# EAGLE design uc4h tfmini v0201 (EAGLE 7.5.0)
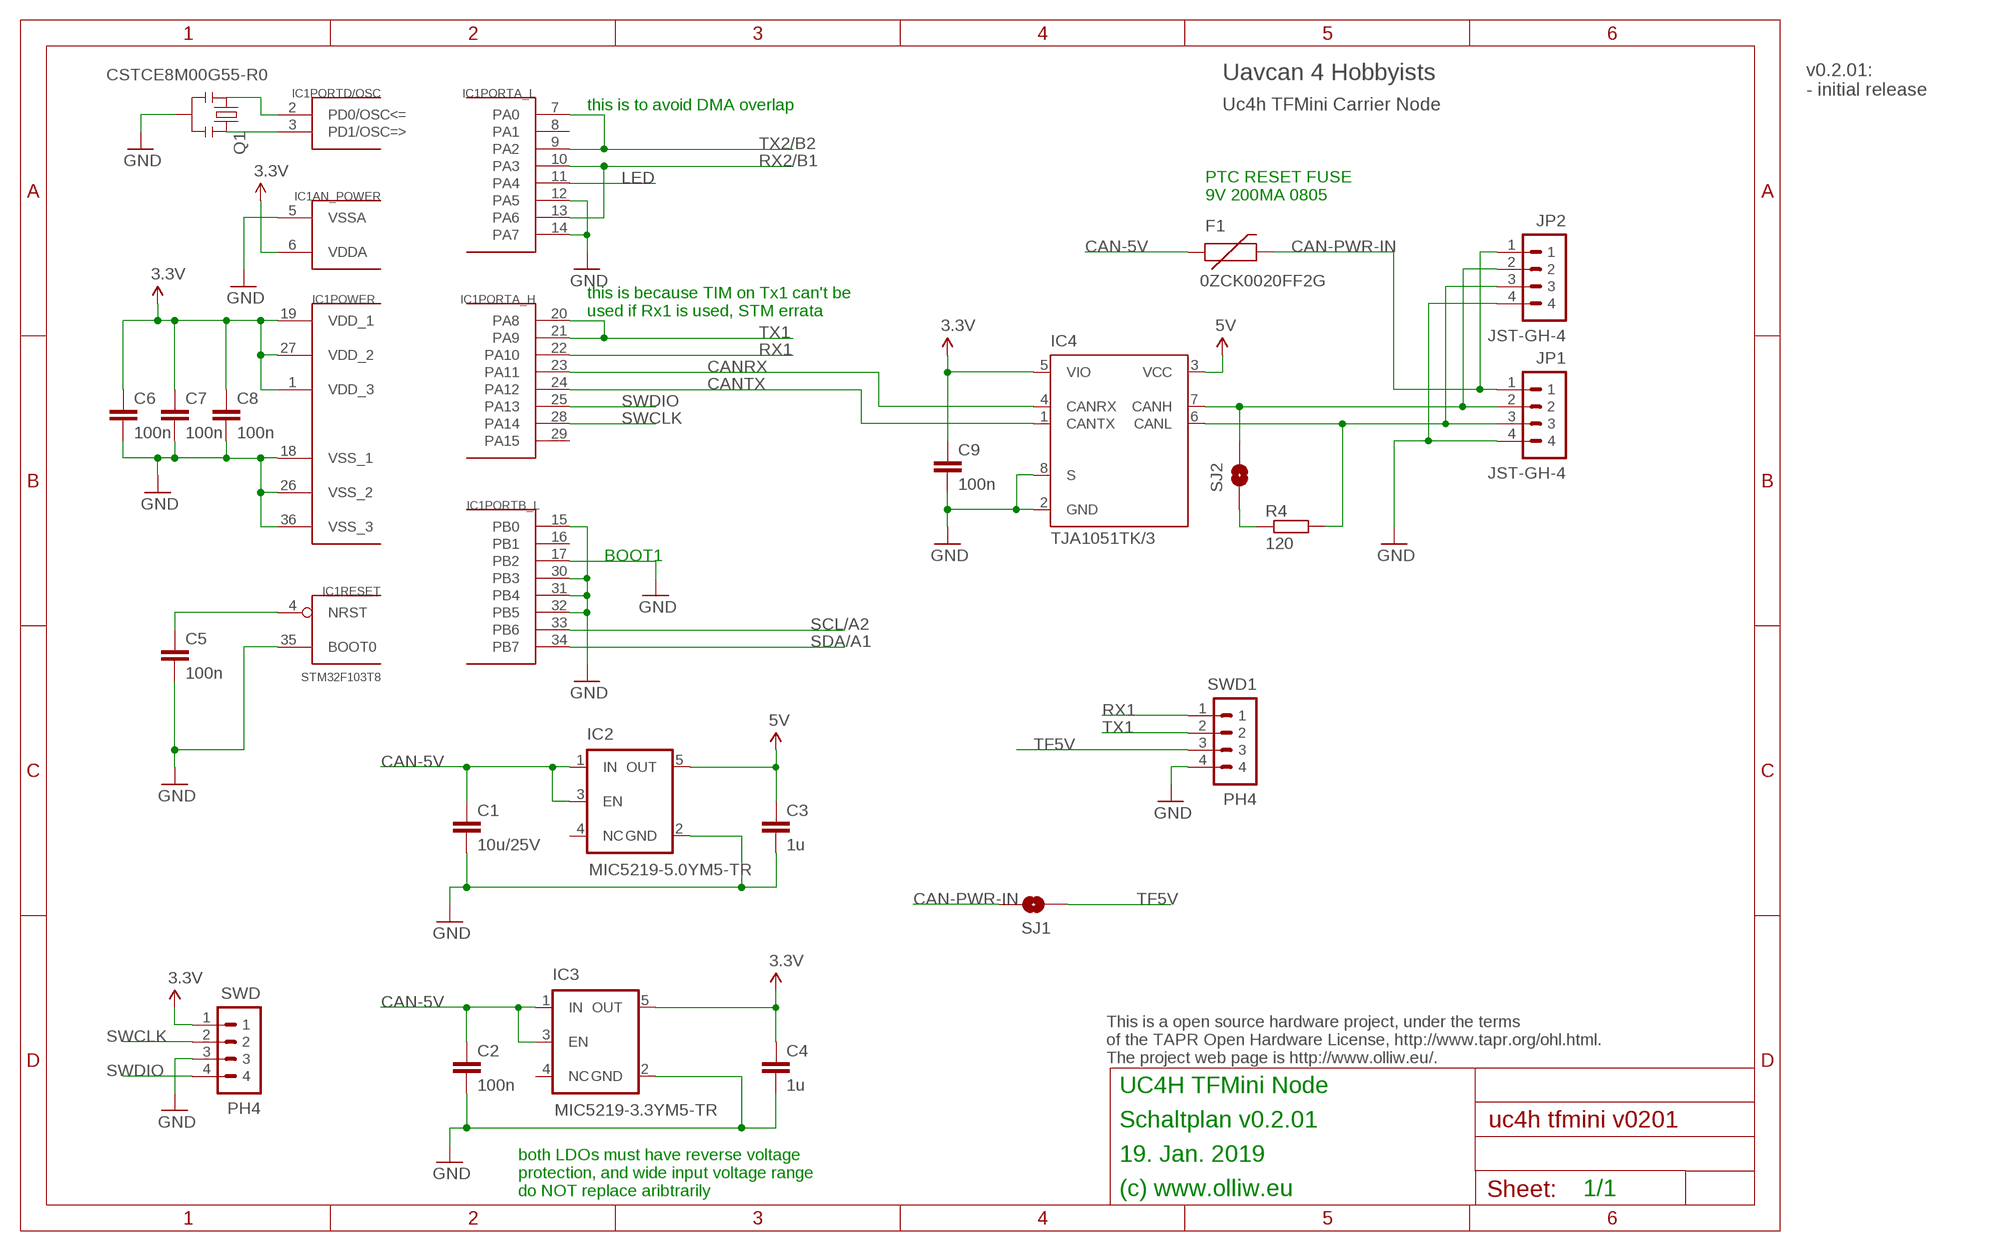
[diagram p0: schematic, sheet 1]

## Parts
C1  10u/25V  C-EUC1206  [C1206]
C2  100n  C-EUC0603K  [C0603K]
C3  1u  C-EUC0603K  [C0603K]
C4  1u  C-EUC0603K  [C0603K]
C5  100n  C-EUC0603K  [C0603K]
C6  100n  C-EUC0603K  [C0603K]
C7  100n  C-EUC0603K  [C0603K]
C8  100n  C-EUC0603K  [C0603K]
C9  100n  C-EUC0603K  [C0603K]
F1  0ZCK0020FF2G  FUSE-PTCFUSE-0805  [FUSE-0805]
IC1  STM32F103T8  STM32F10XTXU6  [VFQFPN36]
IC2  MIC5219-5.0YM5-TR  V_REG_TPS76433SOT23-5  [SOT23-5]
IC3  MIC5219-3.3YM5-TR  V_REG_TPS76433SOT23-5  [SOT23-5]
IC4  TJA1051TK/3  [HVSON8]
JP1  JST-GH-4  [SM04B-GHS-TB]
JP2  JST-GH-4  [SM04B-GHS-TB]
Q1  CSTCE8M00G55-R0  RESONATORSMD  [RESONATOR-SMD]
R4  120  R-EU_R0603  [R0603]
SJ1  SOLDERJUMPERNO  [SJ_2S-NO]
SJ2  SOLDERJUMPERNO  [SJ_2S-NO]
SWD  PH4  P4X1_1P27-OCT_BILEX  [4X1_1P27_OCT_BILEX]
SWD1  PH4  P4X1_1P27-OCT_BILEX  [4X1_1P27_OCT_BILEX]

## Nets
3.3V: C4.1 C6.1 C7.1 C8.1 C9.1 IC1.1(POWER:VDD_3) IC1.6(AN_POWER:VDDA) IC1.19(POWER:VDD_1) IC1.27(POWER:VDD_2) IC3.5(OUT) IC4.5(VIO) SWD.1
5V: C3.1 IC2.5(OUT) IC4.3(VCC)
CAN-5V: C1.1 C2.1 F1.1 IC2.1(IN) IC2.3(EN) IC3.1(IN) IC3.3(EN)
CAN-PWR-IN: F1.2 JP1.1 JP2.1 SJ1.2
CANH: IC4.7(CANH) JP1.2 JP2.2 SJ2.2
CANL: IC4.6(CANL) JP1.3 JP2.3 R4.2
CANRX: IC1.23(PORTA_H:PA11) IC4.4(CANRX)
CANTX: IC1.24(PORTA_H:PA12) IC4.1(CANTX)
GND: C1.2 C2.2 C3.2 C4.2 C5.2 C6.2 C7.2 C8.2 C9.2 IC1.5(AN_POWER:VSSA) IC1.12(PORTA_L:PA5) IC1.14(PORTA_L:PA7) IC1.15(PORTB_L:PB0) IC1.17(PORTB_L:PB2) IC1.18(POWER:VSS_1) IC1.26(POWER:VSS_2) IC1.30(PORTB_L:PB3) IC1.31(PORTB_L:PB4) IC1.32(PORTB_L:PB5) IC1.35(RESET:BOOT0) IC1.36(POWER:VSS_3) IC2.2(GND) IC3.2(GND) IC4.2(GND) IC4.8(S) JP1.4 JP2.4 Q1.2 SWD1.4 SWD.3
LED: IC1.11(PORTA_L:PA4)
N$1: C5.1 IC1.4(RESET:NRST)
N$4: R4.1 SJ2.1
N$5: IC1.2(PORTD/OSC:PD0/OSC<=) Q1.1
N$6: IC1.3(PORTD/OSC:PD1/OSC=>) Q1.3
RX1: IC1.22(PORTA_H:PA10) SWD1.1
RX2/B1: IC1.10(PORTA_L:PA3) IC1.13(PORTA_L:PA6)
SCL/A2: IC1.33(PORTB_L:PB6)
SDA/A1: IC1.34(PORTB_L:PB7)
SWCLK: IC1.28(PORTA_H:PA14) SWD.2
SWDIO: IC1.25(PORTA_H:PA13) SWD.4
TF5V: SJ1.1 SWD1.3
TX1: IC1.20(PORTA_H:PA8) IC1.21(PORTA_H:PA9) SWD1.2
TX2/B2: IC1.7(PORTA_L:PA0) IC1.9(PORTA_L:PA2)
Unconnected: IC1.8(PORTA_L:PA1) IC1.16(PORTB_L:PB1) IC1.29(PORTA_H:PA15) IC2.4(NC) IC3.4(NC)

## Notes on the sheet
- v0.2.01:
  - initial release
- Uavcan 4 Hobbyists
- Uc4h TFMini Carrier Node
- this is to avoid DMA overlap
- PTC RESET FUSE
  9V 200MA 0805
- this is because TIM on Tx1 can't be
  used if Rx1 is used, STM errata
- BOOT1
- This is a open source hardware project, under the terms
  of the TAPR Open Hardware License, http://www.tapr.org/ohl.html.
  The project web page is http://www.olliw.eu/.
- UC4H TFMini Node
- Schaltplan v0.2.01
- 19. Jan. 2019
- both LDOs must have reverse voltage
  protection, and wide input voltage range
  do NOT replace aribtrarily
- (c) www.olliw.eu | 1/1

## Library data of the parts
C1-C9 = rcl:C-EU: CAPACITOR, European symbol
F1 = # stdlib:FUSE-PTC
IC1 = # stm32:STM32F10XTXU6: STM32F101/103 36pad VFQPFN36
IC2 IC3 = # SparkFun2:V_REG_TPS76433: Voltage Regulator Older TI part. LDO 150mA regulator. No output by-pass cap option. See V_REG_LDO for a better part.
IC4 = # stdlib:TJA1051TK/3
JP1 JP2 = # stdlib:JST-GH-4
Q1 = # SparkFun2:RESONATOR: Resonator Small SMD resonator. This is the itty bitty 10/20MHz resonators with built in caps. CSTCE10M0G55 and CSTCE20M0V53. Footprint has been reviewed closely but hasn't been tested yet.
R4 = rcl:R-EU_: RESISTOR, European symbol
SJ1 SJ2 = # SparkFun2:SOLDERJUMPER: Solder Jumper Standard SMD solder jumper. Used to automate production. Two varients : Normally Open and Normally Closed are the same, but have different paste layers. NC will have a large amount of paste and should jumper during reflow.
SWD SWD1 = # stdlib:P4X1_1P27

## Board
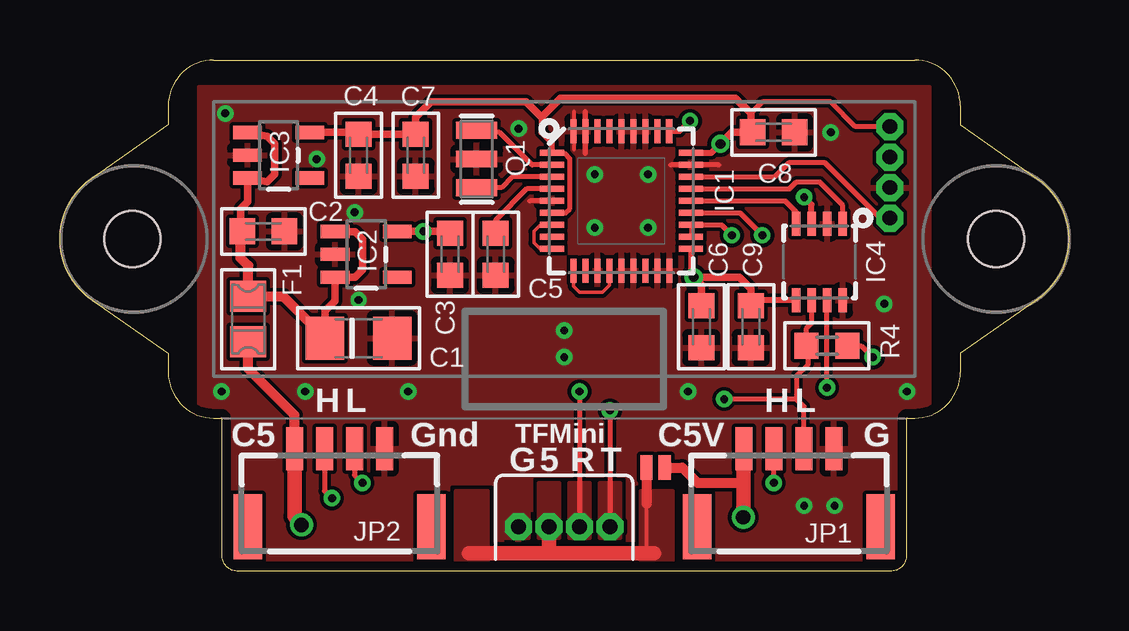
[diagram p1: board, top side]
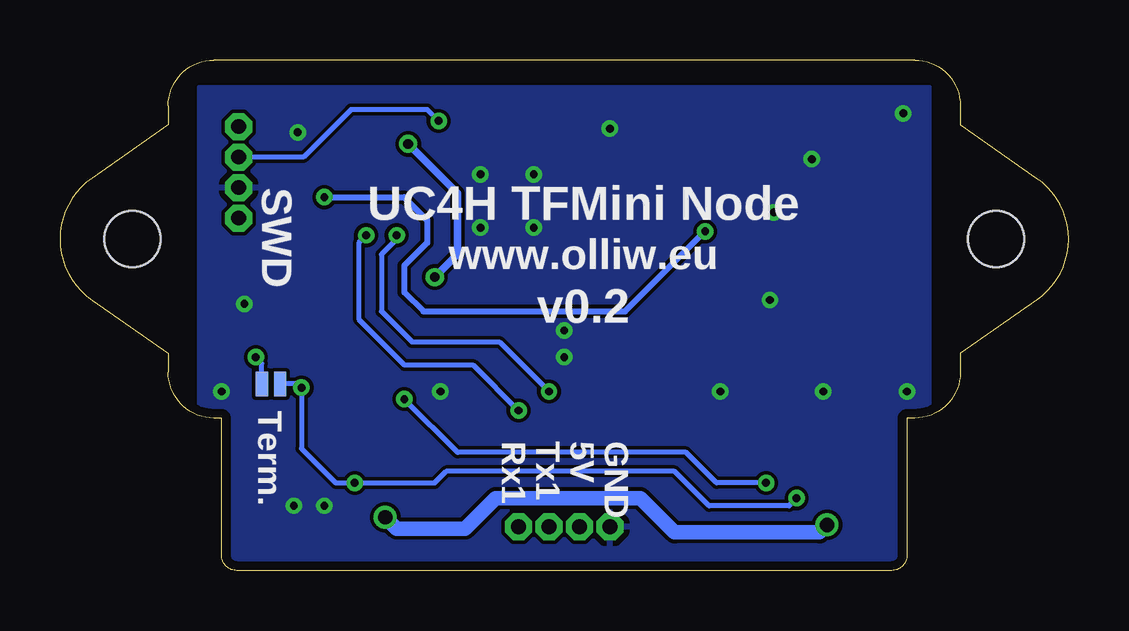
[diagram p2: board, bottom side, seen from below]

Size 42.04 x 21.27 mm. Coordinates in mm from the lower left corner, seen from the top.
Outline: 6.42,21.27 35.63,21.27 arc-90 37.53,19.37 37.53,18.57 40.71,16.35 arc-111 40.71,11.27 37.53,9.05 37.53,8.26 arc-90 35.63,6.35 35.31,6.35 35.31,0.64 arc-90 34.67,0 7.37,0 arc-90 6.73,0.64 6.73,6.35 6.42,6.35 arc-90 4.51,8.26 4.51,9.05 1.34,11.27 arc-111 1.34,16.35 4.51,18.57 4.51,19.37 arc-90 6.42,21.27
Copper layers (1*16): Top 0.0356mm / dielectric 1.5011mm / Bottom 0.0356mm
Design rules "ow-oshpark-2layer": minimum track width 6mil, minimum drill 13mil, track to track 6mil, track to pad 6mil, pad to pad 6mil, via to via 6mil, smd to smd 6mil, copper to edge 15mil, drill to drill 6mil, minimum pad ring 7mil, minimum via ring 7mil, stop-mask expansion 2.5mil, vias tented up to drill 26mil, thermal gap 10mil
Holes 2.35 mm at 3.02,13.81 39.02,13.81

### Footprints (pad centres in the part's own frame; a part is rotated, then mirrored left to right if it is on the bottom)
C1206 = smd 1.6 x 1.8: 1 -1.4,0; 2 1.4,0
C0603K = smd 1.05 x 1.08: 1 -0.875,0; 2 0.875,0
FUSE-0805 = smd 1.3 x 1.5: 1 -0.95,0; 2 0.95,0
VFQFPN36 = smd 1 x 0.25: 1 -2.9,2; 2 -2.9,1.5; 3 -2.9,1; 4 -2.9,0.5; 5 -2.9,0; 6 -2.9,-0.5; 7 -2.9,-1; 8 -2.9,-1.5; 9 -2.9,-2; 19 2.9,-2; 20 2.9,-1.5; 21 2.9,-1; 22 2.9,-0.5; 23 2.9,0; 24 2.9,0.5; 25 2.9,1; 26 2.9,1.5; 27 2.9,2 | smd 0.25 x 1: 10 -2,-2.9; 11 -1.5,-2.9; 12 -1,-2.9; 13 -0.5,-2.9; 14 0,-2.9; 15 0.5,-2.9; 16 1,-2.9; 17 1.5,-2.9; 18 2,-2.9; 29 1.5,2.9; 30 1,2.9; 31 0.5,2.9; 32 0,2.9; 33 -0.5,2.9; 34 -1,2.9; 35 -1.5,2.9; 36 -2,2.9 | smd 0.27 x 1: 28 2,2.9
SOT23-5 = smd 0.55 x 1.2: 1 -0.95,-1.3; 2 0,-1.3; 3 0.95,-1.3; 4 0.95,1.3; 5 -0.95,1.3
HVSON8 = smd 1 x 0.35: 1 -1.6,0.975; 2 -1.6,0.325; 3 -1.6,-0.325; 4 -1.6,-0.975; 5 1.6,-0.975; 6 1.6,-0.325; 7 1.6,0.325; 8 1.6,0.975
SM04B-GHS-TB = smd 0.7 x 1.8: 1 -1.875,4.6; 2 -0.625,4.6; 3 0.625,4.6; 4 1.875,4.6 | smd 1.2 x 2.7: FIT@1 -3.825,1.35; FIT@2 3.825,1.35
RESONATOR-SMD = smd 0.7 x 1.7: 1 -1.2,0; 2 0,0; 3 1.2,0
R0603 = smd 1 x 1.1: 1 -0.85,0; 2 0.85,0
SJ_2S-NO = smd 0.508 x 1.016: 1 -0.381,0; 2 0.381,0
4X1_1P27_OCT_BILEX = drill 0.61 pad 1.118 octagon: 1 0,0; 2 0,-1.27; 3 0,-2.54; 4 0,-3.81

### Placement (x,y rotation side)
C1  12.45,9.68 0 top
C2  8.48,14.13 0 top
C3  16.26,13.18 270 top
C4  12.45,17.3 270 top
C5  18.16,13.18 270 top
C6  26.74,10.16 270 top
C7  14.83,17.3 270 top
C8  29.75,18.26 0 top
C9  28.8,10.16 270 top
F1  7.84,10.48 270 top
IC1  23.4,15.4 0 top
IC2  12.77,13.18 270 top
IC3  9.11,17.3 270 top
IC4  31.66,12.86 270 top
JP1  30.39,0.48 0 top
JP2  11.65,0.48 0 top
Q1  17.37,17.14 270 top
R4  31.97,9.37 180 top
SJ1  24.83,4.29 0 top
SJ2  33.24,7.78 0 bottom
SWD  34.59,18.49 0 top
SWD1  22.93,1.83 270 top

### Tracks (layer width: path | path; a pad name or v marks a point on that pad's centre or on a via)
3.3V  (via drill 0.4)
  Top 0.152: 28.8,18.49 C8.1 | 12.53,18.25 C4.1 | 28.87,11.26 C9.1
  Top 0.203: SWD.1 33.17,18.49 32.13,19.53 29.28,19.53 28.8,19.05 | IC1.6 21.08,14.9 21.26,15.08 21.26,17.15 21.01,17.4 IC1.1
  Top 0.254: 20.07,18.89 20.07,18.26 20.5,17.82 IC1.1 | IC1.19 26.3,12.5 v26.42,12.22 | IC1.27 27.15,17.4 v27.53,17.78 | IC4.5 28.87,11.26
  Top 0.305: 28.8,18.49 28.8,19.05 28.17,19.69 20.86,19.69 20.07,18.89 19.43,19.53 15.47,19.53 14.83,18.89 C7.1 C4.1 | IC3.5 12.53,18.25 | C6.1 26.74,11.91 v26.42,12.22 28.32,12.22 28.8,11.75 C9.1 | C8.1 28.01,18.26 v27.53,17.78
  Bottom 0.305: v26.42,12.22 25.47,13.18 25.47,15.72 v27.53,17.78
5V  (via drill 0.33)
  Top 0.152: 13.91,14.13 IC2.5 | 16.18,14.13 C3.1
  Top 0.254: IC4.3 31.33,15.25 v31.02,15.56
  Top 0.305: 13.91,14.13 v15.15,14.13 16.18,14.13
  Bottom 0.254: v31.02,15.56 27.69,15.56 26.74,14.61 26.74,13.65 27.69,12.7 27.69,11.59 26.9,10.8 18.48,10.8 v15.15,14.13
CAN-5V
  Top 0.152: 7.53,14.21 C2.1 7.53,14.05
  Top 0.305: IC3.1 8.64,18.1 8.96,17.78 8.96,16.51 8.64,16.2 IC3.3 7.82,15.37 7.53,15.08 7.53,14.21 | IC2.1 12.29,14.13 12.61,13.81 12.61,12.54 12.29,12.23 IC2.3 11.47,11.24 11.05,10.82 C1.1
  Top 0.406: 7.53,14.05 7.53,13.02 7.85,12.7 F1.1 9.31,11.43 C1.1
CAN-PWR-IN  (via drill 0.6)
  Top 0.152: 28.48,5.05 JP1.1
  Top 0.406: JP2.1 9.78,6.48 7.85,8.41 F1.2 | SJ1.2 25.94,4.29 26.58,3.65 28.48,3.65
  Top 0.61: JP2.1 9.78,2.25 v10.07,1.91 | v28.48,2.22 28.48,3.65 28.48,5.05
  Bottom 0.61: v10.07,1.91 10.39,1.59 16.42,1.59 17.85,3.02 23.88,3.02 25.15,1.75 28.01,1.75 v28.48,2.22
CANH  (via drill 0.33)
  Top 0.152: JP1.2
  Top 0.203: v29.75,3.65 JP1.2 | v31.98,7.62 31.98,11.09 IC4.7 | JP2.2 11.03,3.32 v11.34,3.02
  Bottom 0.203: v11.34,3.02 11.66,2.7 14.99,2.7 16.42,4.13 25.94,4.13 26.42,3.65 v29.75,3.65 30.55,3.65 31.98,5.08 v31.98,7.62 32.13,7.78 SJ2.2
CANL  (via drill 0.33)
  Top 0.152: 31.18,5.07 JP1.3 | 31.17,9.16 R4.2
  Top 0.203: IC4.6 31.33,10.31 31.13,10.1 R4.2 | 31.17,9.16 31.17,8.56 30.71,8.1 30.71,7.14 | 30.71,7.14 31.01,6.84 JP1.3 | 30.71,7.14 v27.69,7.14 | JP2.3 12.28,3.98 v12.61,3.65
  Bottom 0.203: v12.61,3.65 14.67,3.65 15.94,4.92 25.47,4.92 v27.69,7.14
CANRX
  Top 0.203: IC1.23 30.23,15.4 30.68,14.95 IC4.4
CANTX
  Top 0.203: IC4.1 32.63,15.22 31.66,16.19 30.71,16.19 30.41,15.9 IC1.24
GND  (via drill 0.33)
  Top 0.152: 21.42,19.13 21.42,17.54
  Top 0.203: 20.86,15.4 19.59,15.4 | 27.45,16.91 25.47,16.91 | 21.89,19.13 21.89,17.38
  other vias: 6.89,19.05 32.13,18.26 19.12,18.41 10.7,17.14 22.29,16.51 24.51,16.51 24.51,14.29 22.29,14.29 21.02,8.89 21.02,10 6.73,7.46 35.31,7.46 10.23,7.46 32.29,2.7 14.51,7.46 12.45,11.27 12.29,14.92 26.18,7.46 34.36,11.11 31.02,2.7
  pour Top (rank 2): 5.78,20.16 36.26,20.16 36.26,-0.16 5.78,-0.16
  pour Bottom: 5.78,20.16 36.26,20.16 36.26,-0.79 5.78,-0.79
  pour Top (isolate 0.203, no thermals): 19.55,3.65 19.55,1.35 18.32,1.35 18.32,3.65
N$1
  Top 0.203: IC1.4 19.46,15.9 18.16,14.61 C5.1
N$4  (via drill 0.33)
  Top 0.203: R4.1 33.4,9.37 v33.88,8.89
  Bottom 0.203: SJ2.1 33.63,8.64 v33.88,8.89
N$5
  Top 0.152: 17.62,18.26 Q1.1
  Top 0.203: IC1.2 19.68,16.9 18.32,18.26 17.62,18.26
N$6
  Top 0.152: 17.54,15.95 Q1.3
  Top 0.203: IC1.3 18.85,16.4 18.4,15.95 17.54,15.95
RX1  (via drill 0.33)
  Top 0.203: IC1.22 28.35,14.9 v29.28,13.97 | v22.93,6.67 SWD1.1
  Bottom 0.203: v29.28,13.97 29.59,13.65 29.59,10.48 27.69,8.57 24.83,8.57 v22.93,6.67
  pour Top (isolate 0.203, no thermals): 22.49,3.65 22.49,1.35 23.36,1.35 23.36,3.65
RX2/B1
  Top 0.152: IC1.10 21.4,11.84 21.66,11.59 22.61,11.59 22.9,11.88 IC1.13
SWCLK  (via drill 0.33)
  Top 0.203: IC1.28 25.83,18.3 v26.26,18.73
  Bottom 0.203: v26.26,18.73 26.74,19.21 29.91,19.21 31.9,17.22 SWD.2
SWDIO
  Top 0.203: IC1.25 29.8,16.4 30.39,16.99 31.9,16.99 34.2,14.68 SWD.4
TF5V
  Top 0.152: 24.51,2.7 24.45,2.76 24.45,0.73 24.75,0.71
  Top 0.406: SJ1.1 24.45,2.76
  Top 0.61: 24.75,0.71 20.39,0.71 | 20.39,0.71 17.05,0.71 | SWD1.3 20.39,0.71
  pour Top (isolate 0.305): 24.2,3.33 25.55,3.33 25.55,0.32 24.2,0.32
  pour Top (isolate 0.305): 16.5,3.33 17.85,3.33 17.85,0.32 16.5,0.32
  pour Top (isolate 0.203, no thermals): 19.95,1.35 19.95,3.65 20.82,3.65 20.82,1.35
TX1  (via drill 0.33)
  Top 0.152: IC1.21 IC1.20
  Top 0.203: v21.66,7.46 SWD1.2 | IC1.21 27.58,14.4 v28.01,13.97
  Bottom 0.203: v28.01,13.97 28.01,13.81 28.64,13.18 28.64,10.8 27.37,9.53 23.72,9.53 v21.66,7.46
  pour Top (isolate 0.203, no thermals): 21.22,3.65 21.22,1.35 22.09,1.35 22.09,3.65
TX2/B2
  Top 0.152: IC1.7 20.02,14.4 19.75,14.13 19.75,13.65 20.01,13.4 IC1.9

### Text on the board
tNames: H | L | H | L | C5 | Gnd | TFMini | C5V | G | G | 5 | R | T
bNames: SWD | UC4H TFMini Node | www.olliw.eu | v0.2 | Term. | GND | 5V | Tx1 | Rx1